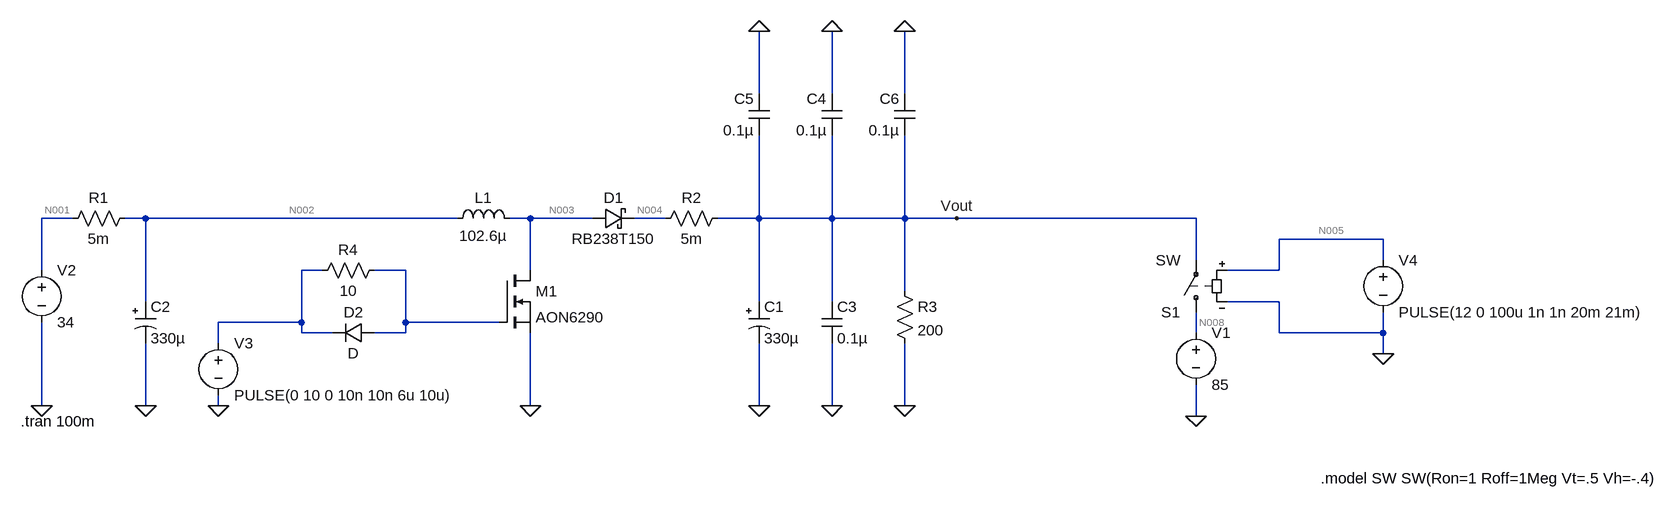
[diagram p0: schematic Symulacja_MPPT.asc]
Symulacja_MPPT.asc, the LTspice schematic file:
Version 4
SHEET 1 1784 680
WIRE 352 -96 352 -192
WIRE 464 -96 464 -192
WIRE 576 -96 576 -192
WIRE -704 96 -752 96
WIRE -592 96 -624 96
WIRE -112 96 -592 96
WIRE 0 96 -32 96
WIRE 96 96 0 96
WIRE 208 96 160 96
WIRE 352 96 352 -32
WIRE 352 96 288 96
WIRE 464 96 464 -32
WIRE 464 96 352 96
WIRE 576 96 576 -32
WIRE 576 96 464 96
WIRE 656 96 576 96
WIRE 1024 96 656 96
WIRE 1312 128 1152 128
WIRE 1024 160 1024 96
WIRE 1312 160 1312 128
WIRE -752 176 -752 96
WIRE -320 176 -352 176
WIRE -192 176 -240 176
WIRE 0 176 0 96
WIRE 1152 176 1152 128
WIRE 1152 176 1072 176
WIRE 576 208 576 96
WIRE -592 224 -592 96
WIRE 352 224 352 96
WIRE 464 224 464 96
WIRE 1152 224 1072 224
WIRE -352 256 -352 176
WIRE -352 256 -480 256
WIRE -192 256 -192 176
WIRE -48 256 -192 256
WIRE -352 272 -352 256
WIRE -304 272 -352 272
WIRE -192 272 -192 256
WIRE -192 272 -240 272
WIRE 1024 272 1024 240
WIRE 1152 272 1152 224
WIRE 1312 272 1312 240
WIRE 1312 272 1152 272
WIRE -480 288 -480 256
WIRE 1312 304 1312 272
WIRE -752 384 -752 256
WIRE -592 384 -592 288
WIRE -480 384 -480 368
WIRE 0 384 0 272
WIRE 352 384 352 288
WIRE 464 384 464 288
WIRE 576 384 576 288
WIRE 1024 400 1024 352
FLAG -752 384 0
FLAG 0 384 0
FLAG 576 384 0
FLAG -480 384 0
FLAG 352 384 0
FLAG -592 384 0
FLAG 464 384 0
FLAG 464 -192 0
FLAG 352 -192 0
FLAG 576 -192 0
FLAG 1024 400 0
FLAG 656 96 Vout
FLAG 1312 304 0
SYMBOL voltage 1024 256 R0
WINDOW 123 0 0 Left 0
WINDOW 39 0 0 Left 0
SYMATTR InstName V1
SYMATTR Value 85
SYMBOL voltage -752 160 R0
WINDOW 123 0 0 Left 0
WINDOW 39 0 0 Left 0
SYMATTR InstName V2
SYMATTR Value 34
SYMBOL res -608 80 R90
WINDOW 0 0 56 VBottom 2
WINDOW 3 32 56 VTop 2
SYMATTR InstName R1
SYMATTR Value 5m
SYMBOL res 304 80 R90
WINDOW 0 0 56 VBottom 2
WINDOW 3 32 56 VTop 2
SYMATTR InstName R2
SYMATTR Value 5m
SYMBOL ind -128 112 R270
WINDOW 0 32 56 VTop 2
WINDOW 3 5 56 VBottom 2
SYMATTR InstName L1
SYMATTR Value 102.6µ
SYMATTR SpiceLine Ipk=20 Rser=0.005 Rpar=0 Cpar=0
SYMBOL schottky 96 112 R270
WINDOW 0 32 32 VTop 2
WINDOW 3 0 32 VBottom 2
SYMATTR InstName D1
SYMATTR Value RB238T150
SYMATTR Description Diode
SYMATTR Type diode
SYMBOL nmos -48 176 R0
SYMATTR InstName M1
SYMATTR Value AON6290
SYMBOL voltage -480 272 R0
WINDOW 123 0 0 Left 0
WINDOW 39 0 0 Left 0
SYMATTR InstName V3
SYMATTR Value PULSE(0 10 0 10n 10n 6u 10u)
SYMBOL res 560 192 R0
SYMATTR InstName R3
SYMATTR Value 200
SYMBOL polcap 336 224 R0
WINDOW 3 24 56 Left 2
SYMATTR Value 330µ
SYMATTR InstName C1
SYMATTR Description Capacitor
SYMATTR Type cap
SYMATTR SpiceLine V=200 Irms=3.22 Rser=0.129477 Lser=10.0366n mfg="Würth Elektronik" pn="860241081001 WCAP-AT1H 18x35,5" type="Al electrolytic"
SYMBOL polcap -608 224 R0
WINDOW 3 24 56 Left 2
SYMATTR Value 330µ
SYMATTR InstName C2
SYMATTR Description Capacitor
SYMATTR Type cap
SYMATTR SpiceLine V=200 Irms=3.22 Rser=0.129477 Lser=10.0366n mfg="Würth Elektronik" pn="860241081001 WCAP-AT1H 18x35,5" type="Al electrolytic"
SYMBOL cap 448 224 R0
SYMATTR InstName C3
SYMATTR Value 0.1µ
SYMATTR SpiceLine V=200 Irms=0 Rser=0.0176148 Lser=626.676p mfg="Würth Elektronik" pn="885342209002 WCAP-CSMH 1210" type="X7R"
SYMBOL cap 480 -32 R180
WINDOW 0 24 56 Left 2
WINDOW 3 24 8 Left 2
SYMATTR InstName C4
SYMATTR Value 0.1µ
SYMATTR SpiceLine V=200 Irms=0 Rser=0.0176148 Lser=626.676p mfg="Würth Elektronik" pn="885342209002 WCAP-CSMH 1210" type="X7R"
SYMBOL cap 368 -32 R180
WINDOW 0 24 56 Left 2
WINDOW 3 24 8 Left 2
SYMATTR InstName C5
SYMATTR Value 0.1µ
SYMATTR SpiceLine V=200 Irms=0 Rser=0.0176148 Lser=626.676p mfg="Würth Elektronik" pn="885342209002 WCAP-CSMH 1210" type="X7R"
SYMBOL cap 592 -32 R180
WINDOW 0 24 56 Left 2
WINDOW 3 24 8 Left 2
SYMATTR InstName C6
SYMATTR Value 0.1µ
SYMATTR SpiceLine V=200 Irms=0 Rser=0.0176148 Lser=626.676p mfg="Würth Elektronik" pn="885342209002 WCAP-CSMH 1210" type="X7R"
SYMBOL res -224 160 R90
WINDOW 0 0 56 VBottom 2
WINDOW 3 32 56 VTop 2
SYMATTR InstName R4
SYMATTR Value 10
SYMBOL diode -240 256 R90
WINDOW 0 0 32 VBottom 2
WINDOW 3 32 32 VTop 2
SYMATTR InstName D2
SYMBOL voltage 1312 144 R0
WINDOW 123 0 0 Left 0
WINDOW 39 0 0 Left 0
SYMATTR InstName V4
SYMATTR Value PULSE(12 0 100u 1n 1n 20m 21m)
SYMBOL sw 1024 256 R180
SYMATTR InstName S1
TEXT -784 408 Left 2 !.tran 100m
TEXT 1216 496 Left 2 !.model SW SW(Ron=1 Roff=1Meg Vt=.5 Vh=-.4)

The netlist it stands for:
* Symulacja_MPPT.asc
V1 N008 0 85
V2 N001 0 34
R1 N002 N001 5m
R2 Vout N004 5m
L1 N002 N003 102.6µ Ipk=20 Rser=0.005 Rpar=0 Cpar=0
D1 N003 N004 RB238T150
M1 N003 N007 0 0 AON6290
V3 N006 0 PULSE(0 10 0 10n 10n 6u 10u)
R3 Vout 0 200
C1 Vout 0 330µ V=200 Irms=3.22 Rser=0.129477 Lser=10.0366n mfg="Würth Elektronik" pn="860241081001 WCAP-AT1H 18x35,5" type="Al electrolytic"
C2 N002 0 330µ V=200 Irms=3.22 Rser=0.129477 Lser=10.0366n mfg="Würth Elektronik" pn="860241081001 WCAP-AT1H 18x35,5" type="Al electrolytic"
C3 Vout 0 0.1µ V=200 Irms=0 Rser=0.0176148 Lser=626.676p mfg="Würth Elektronik" pn="885342209002 WCAP-CSMH 1210" type="X7R"
C4 Vout 0 0.1µ V=200 Irms=0 Rser=0.0176148 Lser=626.676p mfg="Würth Elektronik" pn="885342209002 WCAP-CSMH 1210" type="X7R"
C5 Vout 0 0.1µ V=200 Irms=0 Rser=0.0176148 Lser=626.676p mfg="Würth Elektronik" pn="885342209002 WCAP-CSMH 1210" type="X7R"
C6 Vout 0 0.1µ V=200 Irms=0 Rser=0.0176148 Lser=626.676p mfg="Würth Elektronik" pn="885342209002 WCAP-CSMH 1210" type="X7R"
R4 N007 N006 10
D2 N007 N006 D
V4 N005 0 PULSE(12 0 100u 1n 1n 20m 21m)
S1 N008 Vout N005 0 SW
.model D D
.lib standard.dio
.model NMOS NMOS
.model PMOS PMOS
.lib standard.mos
.tran 100m
.model SW SW(Ron=1 Roff=1Meg Vt=.5 Vh=-.4)
.backanno
.end

* Results of the author's LTspice run, read from the files saved beside the schematic
* Operating Point, zero values left out:
*   V(n008) = 85 V
*   V(n001) = 34 V
*   V(n002) = 34 V
*   V(vout) = 84.58 V
*   V(n004) = 84.58 V
*   V(n003) = 34 V
*   V(n005) = 12 V
*   Id(M1) = 1.631 nA
*   Is(M1) = -1.631 nA
*   I(D1) = -402.1 nA
*   I(L1) = -400.4 nA
*   I(R3) = 422.9 mA
*   I(R2) = 402.1 nA
*   I(R1) = 400.4 nA
*   I(S1) = -422.9 mA
*   I(V2) = 400.4 nA
*   I(V1) = -422.9 mA